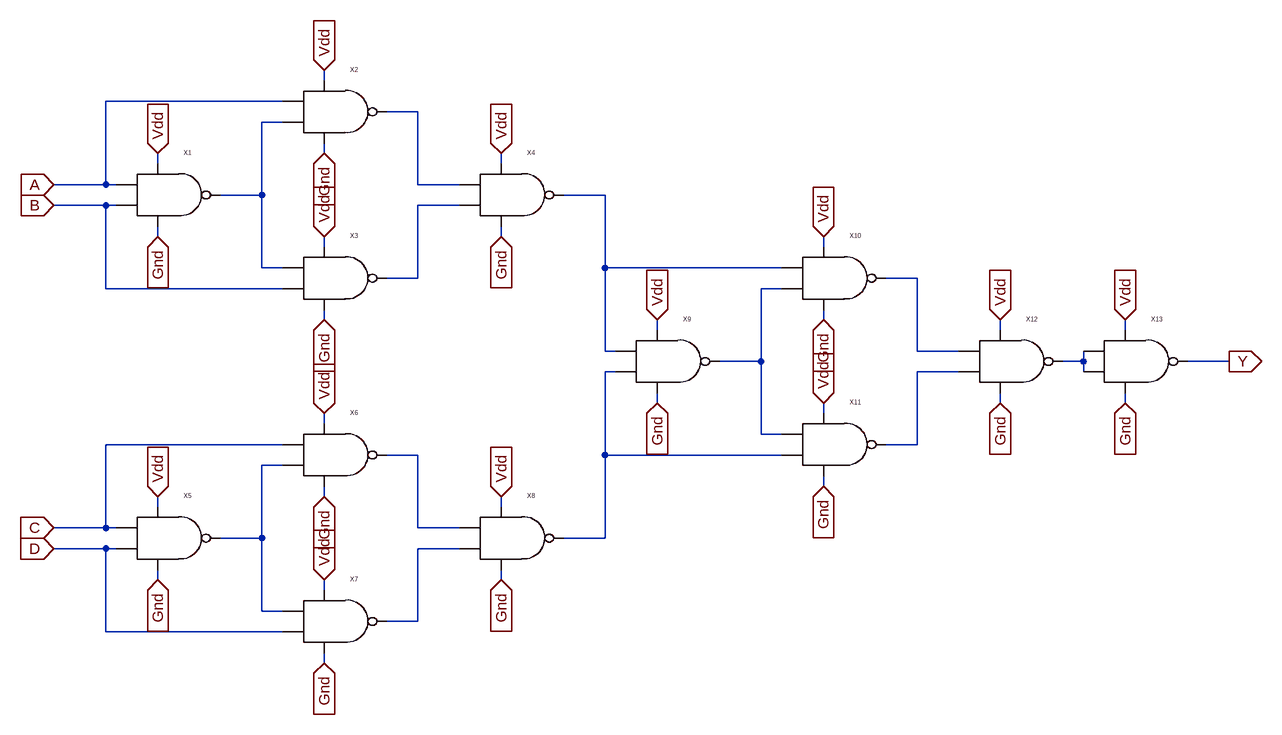
[diagram p0: schematic 4xnor.asc]
4xnor.asc, the LTspice schematic file:
Version 4
SHEET 1 1852 904
WIRE 208 -96 208 -112
WIRE 144 -64 -128 -64
WIRE 352 -48 304 -48
WIRE 144 -32 112 -32
WIRE 208 16 208 0
WIRE -48 32 -48 16
WIRE 480 32 480 16
WIRE -128 64 -128 -64
WIRE -128 64 -208 64
WIRE -112 64 -128 64
WIRE 352 64 352 -48
WIRE 416 64 352 64
WIRE 112 80 112 -32
WIRE 112 80 48 80
WIRE 640 80 576 80
WIRE -128 96 -208 96
WIRE -112 96 -128 96
WIRE 416 96 352 96
WIRE -48 144 -48 128
WIRE 480 144 480 128
WIRE 208 160 208 144
WIRE 976 160 976 144
WIRE 112 192 112 80
WIRE 144 192 112 192
WIRE 640 192 640 80
WIRE 912 192 640 192
WIRE 352 208 352 96
WIRE 352 208 304 208
WIRE 1120 208 1072 208
WIRE -128 224 -128 96
WIRE 144 224 -128 224
WIRE 912 224 880 224
WIRE 208 272 208 256
WIRE 976 272 976 256
WIRE 720 288 720 272
WIRE 1248 288 1248 272
WIRE 1440 288 1440 272
WIRE 640 320 640 192
WIRE 656 320 640 320
WIRE 1120 320 1120 208
WIRE 1184 320 1120 320
WIRE 880 336 880 224
WIRE 880 336 816 336
WIRE 1376 336 1376 320
WIRE 1376 336 1344 336
WIRE 1600 336 1536 336
WIRE 656 352 640 352
WIRE 1184 352 1120 352
WIRE 1376 352 1376 336
WIRE 720 400 720 384
WIRE 1248 400 1248 384
WIRE 1440 400 1440 384
WIRE 976 416 976 400
WIRE 208 432 208 416
WIRE 880 448 880 336
WIRE 912 448 880 448
WIRE 144 464 -128 464
WIRE 1120 464 1120 352
WIRE 1120 464 1072 464
WIRE 352 480 304 480
WIRE 640 480 640 352
WIRE 912 480 640 480
WIRE 144 496 112 496
WIRE 976 528 976 512
WIRE 208 544 208 528
WIRE -48 560 -48 544
WIRE 480 560 480 544
WIRE -128 592 -128 464
WIRE -128 592 -208 592
WIRE -112 592 -128 592
WIRE 352 592 352 480
WIRE 416 592 352 592
WIRE 112 608 112 496
WIRE 112 608 48 608
WIRE 640 608 640 480
WIRE 640 608 576 608
WIRE -128 624 -208 624
WIRE -112 624 -128 624
WIRE 416 624 352 624
WIRE -48 672 -48 656
WIRE 480 672 480 656
WIRE 208 688 208 672
WIRE 112 720 112 608
WIRE 144 720 112 720
WIRE 352 736 352 624
WIRE 352 736 304 736
WIRE -128 752 -128 624
WIRE 144 752 -128 752
WIRE 208 800 208 784
FLAG 208 -112 Vdd
IOPIN 208 -112 In
FLAG -48 16 Vdd
IOPIN -48 16 In
FLAG 208 144 Vdd
IOPIN 208 144 In
FLAG 480 16 Vdd
IOPIN 480 16 In
FLAG -208 624 D
IOPIN -208 624 In
FLAG -208 592 C
IOPIN -208 592 In
FLAG -208 64 A
IOPIN -208 64 In
FLAG -208 96 B
IOPIN -208 96 In
FLAG 480 144 Gnd
IOPIN 480 144 In
FLAG 208 272 Gnd
IOPIN 208 272 In
FLAG 208 16 Gnd
IOPIN 208 16 In
FLAG -48 144 Gnd
IOPIN -48 144 In
FLAG 208 416 Vdd
IOPIN 208 416 In
FLAG -48 544 Vdd
IOPIN -48 544 In
FLAG 208 672 Vdd
IOPIN 208 672 In
FLAG 480 544 Vdd
IOPIN 480 544 In
FLAG 480 672 Gnd
IOPIN 480 672 In
FLAG 208 800 Gnd
IOPIN 208 800 In
FLAG 208 544 Gnd
IOPIN 208 544 In
FLAG -48 672 Gnd
IOPIN -48 672 In
FLAG 976 144 Vdd
IOPIN 976 144 In
FLAG 720 272 Vdd
IOPIN 720 272 In
FLAG 976 400 Vdd
IOPIN 976 400 In
FLAG 1248 272 Vdd
IOPIN 1248 272 In
FLAG 1248 400 Gnd
IOPIN 1248 400 In
FLAG 976 528 Gnd
IOPIN 976 528 In
FLAG 976 272 Gnd
IOPIN 976 272 In
FLAG 720 400 Gnd
IOPIN 720 400 In
FLAG 1440 272 Vdd
IOPIN 1440 272 In
FLAG 1440 400 Gnd
IOPIN 1440 400 In
FLAG 1600 336 Y
IOPIN 1600 336 Out
SYMBOL nand -48 80 R0
SYMATTR InstName X1
SYMBOL nand 208 -48 R0
SYMATTR InstName X2
SYMBOL nand 208 208 R0
SYMATTR InstName X3
SYMBOL nand 480 80 R0
SYMATTR InstName X4
SYMBOL nand -48 608 R0
SYMATTR InstName X5
SYMBOL nand 208 480 R0
SYMATTR InstName X6
SYMBOL nand 208 736 R0
SYMATTR InstName X7
SYMBOL nand 480 608 R0
SYMATTR InstName X8
SYMBOL nand 720 336 R0
SYMATTR InstName X9
SYMBOL nand 976 208 R0
SYMATTR InstName X10
SYMBOL nand 976 464 R0
SYMATTR InstName X11
SYMBOL nand 1248 336 R0
SYMATTR InstName X12
SYMBOL nand 1440 336 R0
SYMATTR InstName X13

The netlist it stands for:
* 4xnor.asc
XX1 A B Vdd Gnd N002 nand  ; pins A B vdd gnd Y
XX2 A N002 Vdd Gnd N001 nand  ; pins A B vdd gnd Y
XX3 N002 B Vdd Gnd N004 nand  ; pins A B vdd gnd Y
XX4 N001 N004 Vdd Gnd N003 nand  ; pins A B vdd gnd Y
XX5 C D Vdd Gnd N011 nand  ; pins A B vdd gnd Y
XX6 C N011 Vdd Gnd N010 nand  ; pins A B vdd gnd Y
XX7 N011 D Vdd Gnd N012 nand  ; pins A B vdd gnd Y
XX8 N010 N012 Vdd Gnd N008 nand  ; pins A B vdd gnd Y
XX9 N003 N008 Vdd Gnd N006 nand  ; pins A B vdd gnd Y
XX10 N003 N006 Vdd Gnd N005 nand  ; pins A B vdd gnd Y
XX11 N006 N008 Vdd Gnd N009 nand  ; pins A B vdd gnd Y
XX12 N005 N009 Vdd Gnd N007 nand  ; pins A B vdd gnd Y
XX13 N007 N007 Vdd Gnd Y nand  ; pins A B vdd gnd Y
.backanno
.end